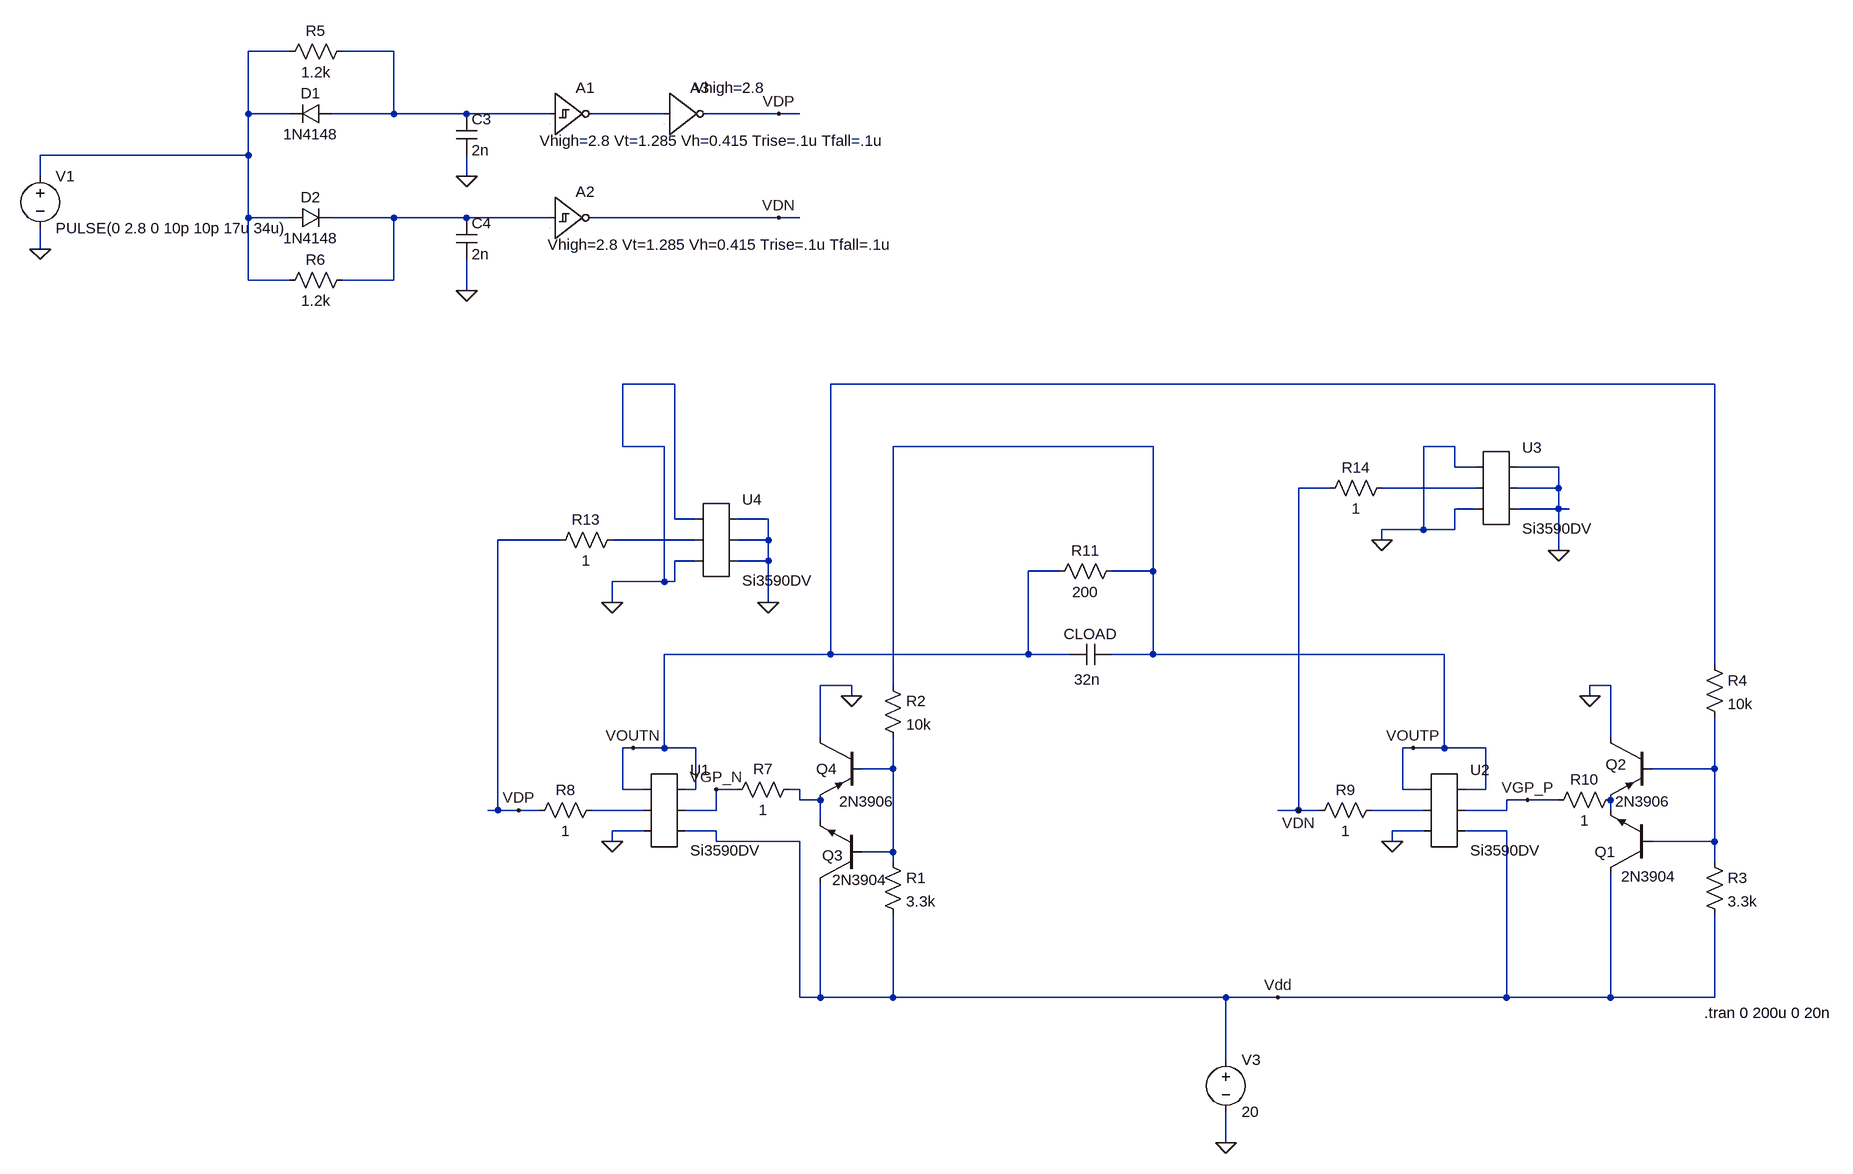
[diagram p0: schematic HbridgePiezo_opt1.asc]
HbridgePiezo_opt1.asc, the LTspice schematic file:
Version 4
SHEET 1 1368 680
WIRE -1136 -1296 -1200 -1296
WIRE -976 -1296 -1056 -1296
WIRE -1200 -1200 -1200 -1296
WIRE -1136 -1200 -1200 -1200
WIRE -976 -1200 -976 -1296
WIRE -976 -1200 -1072 -1200
WIRE -864 -1200 -976 -1200
WIRE -736 -1200 -864 -1200
WIRE -560 -1200 -672 -1200
WIRE -384 -1200 -496 -1200
WIRE -352 -1200 -384 -1200
WIRE -1200 -1136 -1200 -1200
WIRE -1200 -1136 -1520 -1136
WIRE -1520 -1104 -1520 -1136
WIRE -864 -1104 -864 -1136
WIRE -1200 -1040 -1200 -1136
WIRE -1136 -1040 -1200 -1040
WIRE -976 -1040 -1072 -1040
WIRE -864 -1040 -976 -1040
WIRE -736 -1040 -864 -1040
WIRE -384 -1040 -672 -1040
WIRE -352 -1040 -384 -1040
WIRE -1520 -992 -1520 -1024
WIRE -1200 -944 -1200 -1040
WIRE -1136 -944 -1200 -944
WIRE -976 -944 -976 -1040
WIRE -976 -944 -1056 -944
WIRE -864 -928 -864 -976
WIRE -544 -784 -624 -784
WIRE 1056 -784 -304 -784
WIRE -624 -688 -624 -784
WIRE -560 -688 -624 -688
WIRE 192 -688 -208 -688
WIRE 656 -688 608 -688
WIRE 656 -656 656 -688
WIRE 688 -656 656 -656
WIRE 816 -656 752 -656
WIRE 464 -624 416 -624
WIRE 688 -624 544 -624
WIRE 816 -624 816 -656
WIRE 816 -624 752 -624
WIRE 688 -592 656 -592
WIRE 816 -592 816 -624
WIRE 816 -592 752 -592
WIRE 832 -592 816 -592
WIRE -544 -576 -544 -784
WIRE -512 -576 -544 -576
WIRE -400 -576 -448 -576
WIRE 608 -560 608 -688
WIRE 608 -560 544 -560
WIRE 656 -560 656 -592
WIRE 656 -560 608 -560
WIRE -720 -544 -816 -544
WIRE -512 -544 -640 -544
WIRE -400 -544 -400 -576
WIRE -400 -544 -448 -544
WIRE 544 -544 544 -560
WIRE 816 -528 816 -592
WIRE -512 -512 -544 -512
WIRE -400 -512 -400 -544
WIRE -400 -512 -448 -512
WIRE 48 -496 0 -496
WIRE 192 -496 192 -688
WIRE 192 -496 128 -496
WIRE -560 -480 -560 -688
WIRE -560 -480 -640 -480
WIRE -544 -480 -544 -512
WIRE -544 -480 -560 -480
WIRE -640 -448 -640 -480
WIRE -400 -448 -400 -512
WIRE -304 -368 -304 -784
WIRE -304 -368 -560 -368
WIRE 0 -368 0 -496
WIRE 0 -368 -304 -368
WIRE 64 -368 0 -368
WIRE 192 -368 192 -496
WIRE 192 -368 128 -368
WIRE 640 -368 192 -368
WIRE 1056 -352 1056 -784
WIRE -272 -320 -320 -320
WIRE -208 -320 -208 -688
WIRE 896 -320 864 -320
WIRE -272 -304 -272 -320
WIRE 864 -304 864 -320
WIRE -320 -240 -320 -320
WIRE 896 -240 896 -320
WIRE -608 -224 -624 -224
WIRE -560 -224 -560 -368
WIRE -560 -224 -608 -224
WIRE -512 -224 -560 -224
WIRE 592 -224 576 -224
WIRE 640 -224 640 -368
WIRE 640 -224 592 -224
WIRE 704 -224 640 -224
WIRE -208 -192 -208 -240
WIRE -208 -192 -256 -192
WIRE 1056 -192 1056 -272
WIRE 1056 -192 960 -192
WIRE -624 -160 -624 -224
WIRE -592 -160 -624 -160
WIRE -512 -160 -512 -224
WIRE -512 -160 -528 -160
WIRE -448 -160 -480 -160
WIRE -352 -160 -368 -160
WIRE 576 -160 576 -224
WIRE 608 -160 576 -160
WIRE 704 -160 704 -224
WIRE 704 -160 672 -160
WIRE -352 -144 -352 -160
WIRE -320 -144 -352 -144
WIRE 768 -144 736 -144
WIRE 816 -144 768 -144
WIRE -816 -128 -816 -544
WIRE -816 -128 -832 -128
WIRE -784 -128 -816 -128
WIRE -752 -128 -784 -128
WIRE -592 -128 -672 -128
WIRE -480 -128 -480 -160
WIRE -480 -128 -528 -128
WIRE 416 -128 416 -624
WIRE 416 -128 384 -128
WIRE 448 -128 416 -128
WIRE 608 -128 528 -128
WIRE 736 -128 736 -144
WIRE 736 -128 672 -128
WIRE 896 -128 896 -144
WIRE -320 -112 -320 -144
WIRE -592 -96 -640 -96
WIRE -480 -96 -528 -96
WIRE 608 -96 560 -96
WIRE 736 -96 672 -96
WIRE -640 -80 -640 -96
WIRE -480 -80 -480 -96
WIRE -352 -80 -480 -80
WIRE 560 -80 560 -96
WIRE 1056 -80 1056 -192
WIRE 1056 -80 960 -80
WIRE -208 -64 -208 -192
WIRE -208 -64 -256 -64
WIRE -208 -48 -208 -64
WIRE 1056 -48 1056 -80
WIRE -352 160 -352 -80
WIRE -320 160 -320 -16
WIRE -320 160 -352 160
WIRE -208 160 -208 32
WIRE -208 160 -320 160
WIRE 304 160 -208 160
WIRE 384 160 304 160
WIRE 736 160 736 -96
WIRE 736 160 384 160
WIRE 896 160 896 -32
WIRE 896 160 736 160
WIRE 1056 160 1056 32
WIRE 1056 160 896 160
WIRE 304 256 304 160
WIRE 304 384 304 336
FLAG 304 384 0
FLAG -640 -80 0
FLAG 560 -80 0
FLAG 384 160 Vdd
FLAG -784 -128 VDP
FLAG 416 -128 VDN
FLAG 592 -224 VOUTP
FLAG -608 -224 VOUTN
FLAG -480 -160 VGP_N
FLAG 768 -144 VGP_P
FLAG -864 -1104 0
FLAG -864 -928 0
FLAG -1520 -992 0
FLAG -384 -1200 VDP
FLAG -384 -1040 VDN
FLAG -272 -304 0
FLAG 864 -304 0
FLAG 544 -544 0
FLAG -640 -448 0
FLAG -400 -448 0
FLAG 816 -528 0
SYMBOL voltage -1520 -1120 R0
WINDOW 123 0 0 Left 2
WINDOW 39 0 0 Left 2
SYMATTR InstName V1
SYMATTR Value PULSE(0 2.8 0 10p 10p 17u 34u)
SYMBOL voltage 304 240 R0
WINDOW 123 0 0 Left 2
WINDOW 39 24 124 Left 2
SYMATTR InstName V3
SYMATTR Value 20
SYMBOL res -224 -64 R0
SYMATTR InstName R1
SYMATTR Value 3.3k
SYMATTR SpiceLine tol=5
SYMBOL res -224 -336 R0
SYMATTR InstName R2
SYMATTR Value 10k
SYMATTR SpiceLine tol=5
SYMBOL res 1040 -64 R0
SYMATTR InstName R3
SYMATTR Value 3.3k
SYMATTR SpiceLine tol=5
SYMBOL res 1040 -368 R0
SYMATTR InstName R4
SYMATTR Value 10k
SYMATTR SpiceLine tol=5
SYMBOL diode -1072 -1216 R90
WINDOW 0 0 32 VBottom 2
WINDOW 3 32 32 VTop 2
SYMATTR InstName D1
SYMATTR Value 1N4148
SYMBOL diode -1136 -1024 R270
WINDOW 0 32 32 VTop 2
WINDOW 3 0 32 VBottom 2
SYMATTR InstName D2
SYMATTR Value 1N4148
SYMBOL res -1040 -1312 R90
WINDOW 0 0 56 VBottom 2
WINDOW 3 32 56 VTop 2
SYMATTR InstName R5
SYMATTR Value 1.2k
SYMATTR SpiceLine tol=5
SYMBOL res -1040 -960 R90
WINDOW 0 0 56 VBottom 2
WINDOW 3 32 56 VTop 2
SYMATTR InstName R6
SYMATTR Value 1.2k
SYMATTR SpiceLine tol=5
SYMBOL cap -880 -1200 R0
SYMATTR InstName C3
SYMATTR Value 2n
SYMBOL cap -880 -1040 R0
SYMATTR InstName C4
SYMATTR Value 2n
SYMBOL Digital\\schmtinv -736 -1264 R0
WINDOW 3 -16 105 Left 2
SYMATTR Value Vhigh=2.8 Vt=1.285 Vh=0.415 Trise=.1u Tfall=.1u
SYMATTR InstName A1
SYMBOL Digital\\schmtinv -736 -1104 R0
WINDOW 3 -3 105 Left 2
SYMATTR Value Vhigh=2.8 Vt=1.285 Vh=0.415 Trise=.1u Tfall=.1u
SYMATTR InstName A2
SYMBOL Digital\\inv -560 -1264 R0
WINDOW 3 45 24 Left 2
SYMATTR Value Vhigh=2.8
SYMATTR InstName A3
SYMBOL cap 128 -384 R90
WINDOW 0 0 32 VBottom 2
WINDOW 3 39 37 VTop 2
SYMATTR InstName CLOAD
SYMATTR Value 32n
SYMBOL AutoGenerated\\Si3590DV -560 -128 R0
SYMATTR InstName U1
SYMBOL AutoGenerated\\Si3590DV 640 -128 R0
SYMATTR InstName U2
SYMBOL npn -256 -16 R180
WINDOW 0 29 43 Left 2
WINDOW 3 -39 5 Left 2
SYMATTR InstName Q3
SYMATTR Value 2N3904
SYMBOL pnp -256 -240 M0
WINDOW 0 38 48 Left 2
WINDOW 3 -50 98 Left 2
SYMATTR InstName Q4
SYMATTR Value 2N3906
SYMBOL npn 960 -32 R180
WINDOW 3 -37 -6 Left 2
SYMATTR Value 2N3904
SYMATTR InstName Q1
SYMBOL pnp 960 -240 M0
WINDOW 0 39 41 Left 2
WINDOW 3 -28 98 Left 2
SYMATTR InstName Q2
SYMATTR Value 2N3906
SYMBOL res -352 -176 R90
WINDOW 0 0 56 VBottom 2
WINDOW 3 32 56 VTop 2
SYMATTR InstName R7
SYMATTR Value 1
SYMBOL res -656 -144 R90
WINDOW 0 0 56 VBottom 2
WINDOW 3 32 56 VTop 2
SYMATTR InstName R8
SYMATTR Value 1
SYMBOL res 544 -144 R90
WINDOW 0 0 56 VBottom 2
WINDOW 3 32 56 VTop 2
SYMATTR InstName R9
SYMATTR Value 1
SYMBOL res 912 -160 R90
WINDOW 0 0 56 VBottom 2
WINDOW 3 32 56 VTop 2
SYMATTR InstName R10
SYMATTR Value 1
SYMBOL res -624 -560 R90
WINDOW 0 0 56 VBottom 2
WINDOW 3 32 56 VTop 2
SYMATTR InstName R13
SYMATTR Value 1
SYMBOL res 560 -640 R90
WINDOW 0 0 56 VBottom 2
WINDOW 3 32 56 VTop 2
SYMATTR InstName R14
SYMATTR Value 1
SYMBOL AutoGenerated\\Si3590DV 720 -624 R0
SYMATTR InstName U3
SYMBOL AutoGenerated\\Si3590DV -480 -544 R0
SYMATTR InstName U4
SYMBOL res 144 -512 R90
WINDOW 0 0 56 VBottom 2
WINDOW 3 32 56 VTop 2
SYMATTR InstName R11
SYMATTR Value 200
TEXT 1040 184 Left 2 !.tran 0 200u 0 20n

The netlist it stands for:
* HbridgePiezo_opt1.asc
V1 N001 0 PULSE(0 2.8 0 10p 10p 17u 34u)
V3 Vdd 0 20
R1 N007 Vdd 3.3k tol=5
R2 VOUTP N007 10k tol=5
R3 N008 Vdd 3.3k tol=5
R4 VOUTN N008 10k tol=5
D1 N002 N001 1N4148
D2 N001 N004 1N4148
R5 N002 N001 1.2k tol=5
R6 N004 N001 1.2k tol=5
C3 N002 0 2n
C4 N004 0 2n
A1 N002 0 0 0 0 N003 0 0 SCHMITT Vhigh=2.8 Vt=1.285 Vh=0.415 Trise=.1u Tfall=.1u
A2 N004 0 0 0 0 VDN 0 0 SCHMITT Vhigh=2.8 Vt=1.285 Vh=0.415 Trise=.1u Tfall=.1u
A3 N003 0 0 0 0 VDP 0 0 BUF Vhigh=2.8
CLOAD VOUTP VOUTN 32n
* U1: Si3590DV (symbol AutoGenerated\Si3590DV not available, pins judged from their places): pin1=VOUTN pin2=N010 pin3=0 pin4=VOUTN pin5=VGP_N pin6=Vdd
* U2: Si3590DV (symbol AutoGenerated\Si3590DV not available, pins judged from their places): pin1=VOUTP pin2=N011 pin3=0 pin4=VOUTP pin5=VGP_P pin6=Vdd
Q3 Vdd N007 N009 0 2N3904
Q4 0 N007 N009 0 2N3906
Q1 Vdd N008 N012 0 2N3904
Q2 0 N008 N012 0 2N3906
R7 N009 VGP_N 1
R8 N010 VDP 1
R9 N011 VDN 1
R10 N012 VGP_P 1
R13 N006 VDP 1
R14 N005 VDN 1
* U3: Si3590DV (symbol AutoGenerated\Si3590DV not available, pins judged from their places): pin1=0 pin2=N005 pin3=0 pin4=0 pin5=0 pin6=0
* U4: Si3590DV (symbol AutoGenerated\Si3590DV not available, pins judged from their places): pin1=0 pin2=N006 pin3=0 pin4=0 pin5=0 pin6=0
R11 VOUTP VOUTN 200
.model D D
.lib standard.dio
.model NPN NPN
.model PNP PNP
.lib standard.bjt
.tran 0 200u 0 20n
.backanno
.end